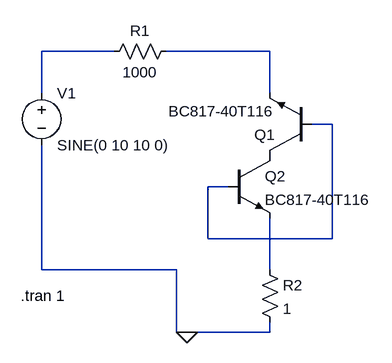
[diagram p0: schematic transistor bypass.asc]
transistor bypass.asc, the LTspice schematic file:
Version 4
SHEET 1 880 680
WIRE -208 32 -320 32
WIRE 32 32 -128 32
WIRE -320 96 -320 32
WIRE 32 96 32 32
WIRE 128 144 96 144
WIRE -32 240 -64 240
WIRE -64 320 -64 240
WIRE 128 320 128 144
WIRE 128 320 -64 320
WIRE -320 368 -320 176
WIRE -112 368 -320 368
WIRE 32 368 32 288
WIRE -112 464 -112 368
WIRE -96 464 -112 464
WIRE 32 464 32 448
WIRE 32 464 -96 464
FLAG -96 464 0
SYMBOL npn -32 192 R0
SYMATTR InstName Q2
SYMATTR Value BC817-40T116
SYMBOL res -112 16 R90
WINDOW 0 0 56 VBottom 2
WINDOW 3 32 56 VTop 2
SYMATTR InstName R1
SYMATTR Value 1000
SYMBOL voltage -320 80 R0
WINDOW 123 0 0 Left 0
WINDOW 39 0 0 Left 0
SYMATTR InstName V1
SYMATTR Value SINE(0 10 10 0)
SYMBOL npn 96 192 R180
SYMATTR InstName Q1
SYMATTR Value BC817-40T116
SYMBOL res 16 352 R0
SYMATTR InstName R2
SYMATTR Value 1
TEXT -352 408 Left 2 !.tran 1

The netlist it stands for:
* transistor bypass.asc
Q2 P001 N003 N004 0 BC817-40T116
R1 N002 N001 1000
V1 N001 0 SINE(0 10 10 0)
Q1 P001 N003 N002 0 BC817-40T116
R2 N004 0 1
.model NPN NPN
.model PNP PNP
.lib standard.bjt
.tran 1
.backanno
.end